# EAGLE design MatchboxARM (EAGLE 6.4)
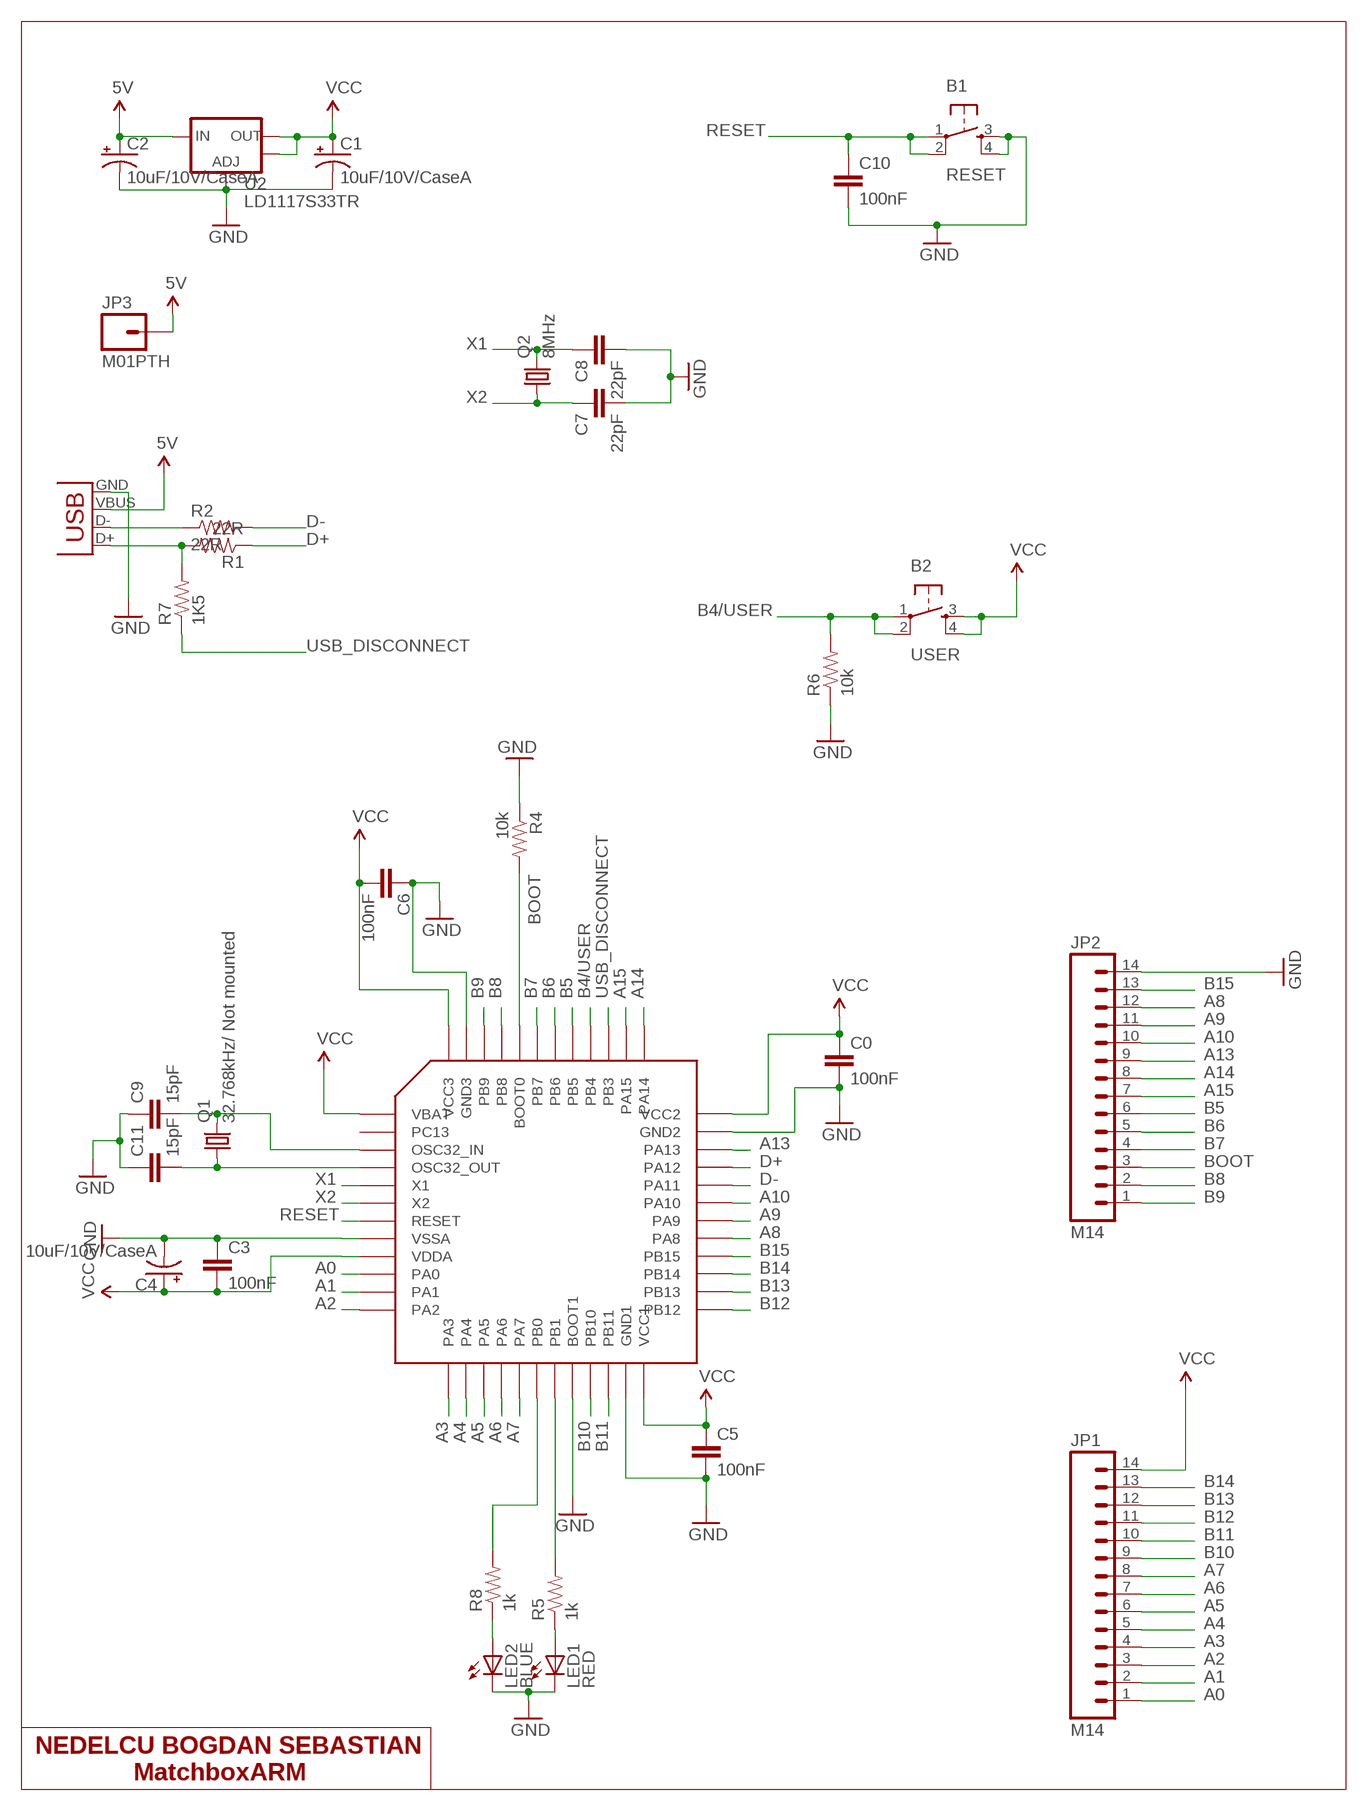
[diagram p0: schematic, sheet 1]

## Parts
B1  RESET  TAC_SWITCHSMD  [TACTILE_SWITCH_SMD]
B2  USER  TAC_SWITCHSMD  [TACTILE_SWITCH_SMD]
C0  100nF  CAP0603-CAP  [0603-CAP]
C1  10uF/10V/CaseA  CAP_POL1206  [EIA3216]
C2  10uF/10V/CaseA  CAP_POL1206  [EIA3216]
C3  100nF  CAP0603-CAP  [0603-CAP]
C4  10uF/10V/CaseA  CAP_POL1206  [EIA3216]
C5  100nF  CAP0603-CAP  [0603-CAP]
C6  100nF  CAP0603-CAP  [0603-CAP]
C7  22pF  CAP0603-CAP  [0603-CAP]
C8  22pF  CAP0603-CAP  [0603-CAP]
C9  15pF  CAP0603-CAP  [0603-CAP]
C10  100nF  CAP0603-CAP  [0603-CAP]
C11  15pF  CAP0603-CAP  [0603-CAP]
JP1  M14  [1X14]
JP2  M14  [1X14]
JP3  M01PTH  [1X01]
LED1  RED  LED0603  [LED-0603]
LED2  BLUE  LED0603  [LED-0603]
Q1  32.768kHz/ Not mounted  CRYSTALTC26V  [TC26V]
Q2  8MHz  CRYSTALCTS406  [CTS406]
R1  22R  RESISTOR0603-RES  [0603-RES]
R2  22R  RESISTOR0603-RES  [0603-RES]
R4  10k  RESISTOR0603-RES  [0603-RES]
R5  1k  RESISTOR0603-RES  [0603-RES]
R6  10k  RESISTOR0603-RES  [0603-RES]
R7  1K5  RESISTOR0603-RES  [0603-RES]
R8  1k  RESISTOR0603-RES  [0603-RES]
U1  STM32F103CBT6  STM32F103CXT6  [STM32F103CXT6]
U2  LD1117S33TR  V_REG_LM1117SOT223  [SOT223]
USB1  miniUSBSMD  USBSMD  [USB-MINIB]

## Nets
5V: C2.A(+) JP3.1 U2.3(IN) USB1.VBUS
A0: JP1.1 U1.10(PA0)
A1: JP1.2 U1.11(PA1)
A2: JP1.3 U1.12(PA2)
A3: JP1.4 U1.13(PA3)
A4: JP1.5 U1.14(PA4)
A5: JP1.6 U1.15(PA5)
A6: JP1.7 U1.16(PA6)
A7: JP1.8 U1.17(PA7)
A8: JP2.12 U1.29(PA8)
A9: JP2.11 U1.30(PA9)
A10: JP2.10 U1.31(PA10)
A13: JP2.9 U1.34(PA13)
A14: JP2.8 U1.37(PA14)
A15: JP2.7 U1.38(PA15)
B4/USER: B2.1 B2.2 R6.2 U1.40(PB4)
B5: JP2.6 U1.41(PB5)
B6: JP2.5 U1.42(PB6)
B7: JP2.4 U1.43(PB7)
B8: JP2.2 U1.45(PB8)
B9: JP2.1 U1.46(PB9)
B10: JP1.9 U1.21(PB10)
B11: JP1.10 U1.22(PB11)
B12: JP1.11 U1.25(PB12)
B13: JP1.12 U1.26(PB13)
B14: JP1.13 U1.27(PB14)
B15: JP2.13 U1.28(PB15)
BOOT: JP2.3 R4.2 U1.44(BOOT0)
D+: R1.1 U1.33(PA12)
D-: R2.2 U1.32(PA11)
GND: B1.3 B1.4 C0.2 C1.C(-) C2.C(-) C3.1 C4.C(-) C5.2 C6.1 C7.2 C8.2 C9.1 C10.2 C11.1 JP2.14 LED1.C LED2.C R4.1 R6.1 U1.8(VSSA) U1.20(BOOT1) U1.23(GND1) U1.35(GND2) U1.47(GND3) U2.1(ADJ) USB1.GND
N$1: R5.2 U1.19(PB1)
N$4: LED2.A R8.1
N$5: LED1.A R5.1
N$6: R8.2 U1.18(PB0)
N$7: C9.2 Q1.2 U1.3(OSC32_IN)
N$8: C11.2 Q1.1 U1.4(OSC32_OUT)
N$9: R2.1 USB1.D-
N$11: R1.2 R7.2 USB1.D+
RESET: B1.1 B1.2 C10.1 U1.7(RESET)
USB_DISCONNECT: R7.1 U1.39(PB3)
VCC: B2.3 B2.4 C0.1 C1.A(+) C3.2 C4.A(+) C5.1 C6.2 JP1.14 U1.1(VBAT) U1.9(VDDA) U1.24(VCC1) U1.36(VCC2) U1.48(VCC3) U2.2(OUT) U2.4(OUT)
X1: C8.1 Q2.3 U1.5(X1)
X2: C7.1 Q2.1 U1.6(X2)
Unconnected: U1.2(PC13)

## Notes on the sheet
- NEDELCU BOGDAN SEBASTIAN
- MatchboxARM

## Library data of the parts
B1 B2 = SparkFun-Electromechanical:TAC_SWITCH: Momentary Switch Button commonly used for reset or general input. Spark Fun Electronics SKU : COM-00097
C0 C3 C5-C11 = SparkFun-Passives:CAP: Capacitor Standard 0603 ceramic capacitor, and 0.1" leaded capacitor.
C1 C2 C4 = SparkFun-Passives:CAP_POL: Capacitor Polarized These are standard SMD and PTH capacitors. Normally 10uF, 47uF, and 100uF in electrolytic and tantalum varieties. Always verify the external diameter of the through hole cap, it varies with capacity, voltage, and manufacturer. The EIA devices should be standard.
JP1 JP2 = SparkFun-Connectors:M14: Header 14 Standard 14-pin 0.1" header. Use with straight break away headers (SKU : PRT-00116), right angle break away headers (PRT-00553), swiss pins (PRT-00743), machine pins (PRT-00117), and female headers (PRT-00115).
JP3 = SparkFun-Connectors:M01: Header 1 Standard 1-pin 0.1" header. Use with straight break away headers (SKU : PRT-00116), right angle break away headers (PRT-00553), swiss pins (PRT-00743), machine pins (PRT-00117), and female headers (PRT-00115).
LED1 LED2 = SparkFun-LED:LED: LEDs Standard schematic elements and footprints for 5mm, 3mm, 1206, and 0603 sized LEDs. 5mm - Spark Fun Electronics SKU : COM-00529 (and others)
Q1 Q2 = crystal:CRYSTAL: CRYSTAL; OC_FARNELL: unknown; OC_NEWARK: unknown
R1 R2 R4-R8 = SparkFun-Passives:RESISTOR: Resistor Basic schematic elements and footprints for 0603, 1206, and PTH resistors.
U1 = STM32F103CxT6:STM32F103CXT6
U2 = SparkFun-PowerIC:V_REG_LM1117: Voltage Regulator LM1117 Standard adjustable voltage regulator but in SMD form. Spark Fun Electronics SKU : COM-00595
USB1 = SparkFun-Connectors:USB: USB Connectors USB-B-PTH is fully proven SKU : PRT-00139 USB-miniB is fully proven SKU : PRT-00587 USB-A-PCB is untested. USB-A-H is throughly reviewed, but untested. Spark Fun Electronics SKU : PRT-00437 USB-B-SMT is throughly reviewed, but untested. Needs silkscreen touching up. USB-A-S has not been used/tested USB-MB-H has not been used/tested

## Board
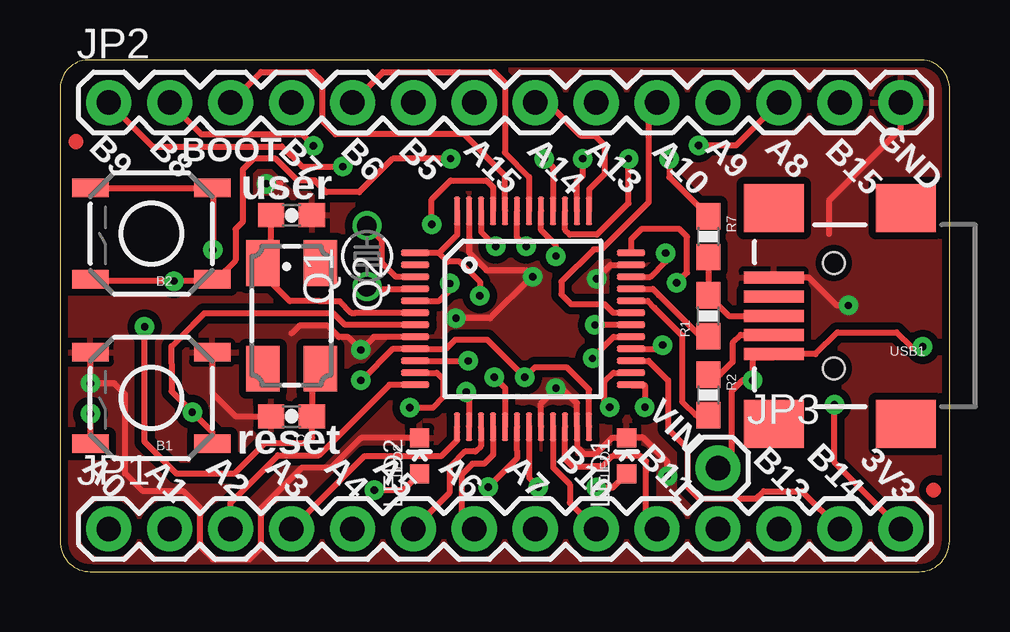
[diagram p1: board, top side]
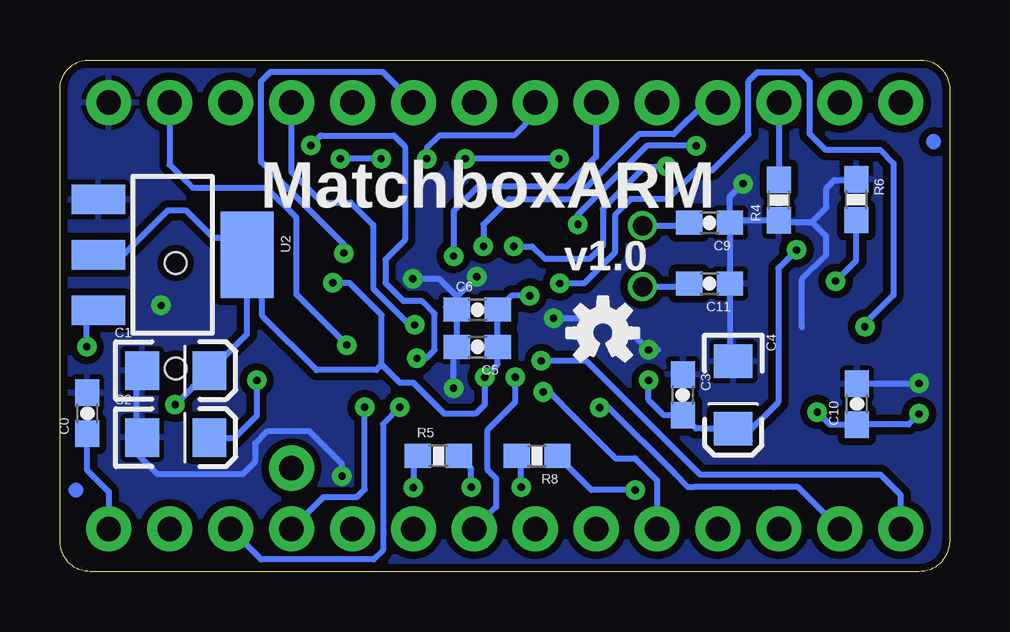
[diagram p2: board, bottom side, seen from below]

Size 37.08 x 21.34 mm. Coordinates in mm from the lower left corner, seen from the top.
Outline: 1.27,0 35.81,0 arc90 37.08,1.27 37.08,20.19 arc90 35.81,21.34 1.27,21.34 arc90 0,20.19 0,1.27 arc90 1.27,0
Copper layers (1*16): Top 0.035mm / dielectric 1.5mm / Bottom 0.035mm
Design rules "PCBCart-Standard *": minimum track width 8mil, minimum drill 0.4mm, track to track 8mil, track to pad 8mil, pad to pad 8mil, via to via 8mil, smd to smd 8mil, copper to edge 10mil, drill to drill 8mil, minimum pad ring 8mil, minimum via ring 10mil, stop-mask expansion 3mil, vias tented up to drill 0mil, thermal gap 8mil
tRestrict: area 0.4,17.6 to 1,18.2; area 36.1,3.1 to 36.7,3.7
bRestrict: area 0.4,17.6 to 1,18.2; area 36.1,3.1 to 36.7,3.7

### Footprints (pad centres in the part's own frame; a part is rotated, then mirrored left to right if it is on the bottom)
TACTILE_SWITCH_SMD = smd 1.524 x 0.762: 1 -2.54,1.905; 2 2.54,1.905; 3 -2.54,-1.905; 4 2.54,-1.905
0603-CAP = smd 1.1 x 1: 1 -0.85,0; 2 0.85,0
EIA3216 = smd 1.4 x 1.6: A 1.4,0; C -1.4,0
1X14 = drill 1.016 pad 1.88: 1 0,0; 2 2.54,0; 3 5.08,0; 4 7.62,0; 5 10.16,0; 6 12.7,0; 7 15.24,0; 8 17.78,0; 9 20.32,0; 10 22.86,0; 11 25.4,0; 12 27.94,0; 13 30.48,0; 14 33.02,0
1X01 = drill 1.016 pad 1.88: 1 0,0
LED-0603 = smd 0.8 x 0.8: A 0,-0.75; C 0,0.75
TC26V = drill 0.813: 1 -1.27,0; 2 1.27,0
CTS406 = smd 1.9 x 1.4: 1 -2.2,-1.2; 2 2.2,-1.2; 3 2.2,1.2; 4 -2.2,1.2
0603-RES = smd 1.1 x 1: 1 -0.85,0; 2 0.85,0
STM32F103CXT6 = smd 1.2 x 0.27: 1 -4.5,2.75; 2 -4.5,2.25; 3 -4.5,1.75; 4 -4.5,1.25; 5 -4.5,0.75; 6 -4.5,0.25; 7 -4.5,-0.25; 8 -4.5,-0.75; 9 -4.5,-1.25; 10 -4.5,-1.75; 11 -4.5,-2.25; 12 -4.5,-2.75; 25 4.5,-2.75; 26 4.5,-2.25; 27 4.5,-1.75; 28 4.5,-1.25; 29 4.5,-0.75; 30 4.5,-0.25; 31 4.5,0.25; 32 4.5,0.75; 33 4.5,1.25; 34 4.5,1.75; 35 4.5,2.25; 36 4.5,2.75 | smd 0.27 x 1.2: 13 -2.75,-4.5; 14 -2.25,-4.5; 15 -1.75,-4.5; 16 -1.25,-4.5; 17 -0.75,-4.5; 18 -0.25,-4.5; 19 0.25,-4.5; 20 0.75,-4.5; 21 1.25,-4.5; 22 1.75,-4.5; 23 2.25,-4.5; 24 2.75,-4.5; 37 2.75,4.5; 38 2.25,4.5; 39 1.75,4.5; 40 1.25,4.5; 41 0.75,4.5; 42 0.25,4.5; 43 -0.25,4.5; 44 -0.75,4.5; 45 -1.25,4.5; 46 -1.75,4.5; 47 -2.25,4.5; 48 -2.75,4.5
SOT223 = smd 1.219 x 2.235: 1 -2.311,-3.099; 2 0,-3.099; 3 2.311,-3.099 | smd 3.6 x 2.2: 4 0,3.099
USB-MINIB = smd 2.5 x 0.5: D+ 2.5,0; D- 2.5,0.8; GND 2.5,-1.6; ID 2.5,-0.8; VBUS 2.5,1.6 | smd 2.5 x 2: MTN1 -3,4.5; MTN2 2.5,4.5; MTN3 -3,-4.5; MTN4 2.5,-4.5 | hole 0.9: 0,2.2; 0,-2.2

### Placement (x,y rotation side)
B1  3.81,7.24 180 top
B2  3.81,14.1 180 top
C0  35.94,6.6 90 bottom
C1  32.26,8.38 0 bottom
C2  32.26,5.59 0 bottom
C3  11.13,7.37 270 bottom
C4  9.02,7.37 270 bottom
C5  19.68,9.37 180 bottom
C6  19.68,10.92 0 bottom
C7  9.65,14.86 0 top
C8  9.65,6.48 180 top
C9  10.01,14.55 180 bottom
C10  3.86,6.98 90 bottom
C11  10.01,12.01 180 bottom
JP1  2.03,1.78 0 top
JP2  2.03,19.56 0 top
JP3  27.43,4.32 0 top
LED1  23.62,4.83 0 top
LED2  14.99,4.83 0 top
Q1  12.8,13.16 90 top
Q2  9.65,10.67 270 top
R1  27.03,10.67 90 top
R2  27.03,7.37 270 top
R4  7.11,15.49 90 bottom
R5  21.31,4.83 0 bottom
R6  3.89,15.51 270 bottom
R7  27.03,13.97 270 top
R8  17.2,4.83 180 bottom
U1  19.3,10.54 0 top
U2  32.38,13.21 270 bottom
U3  CREATIVE_COMMONS  [CREATIVE_COMMONS]  -11.68,-10.9 0 top  (outside the outline)
U$4  OSHW-LOGOS  [OSHW-LOGO-S]  14.45,9.96 0 bottom
USB1  32.26,10.67 180 top

### Tracks (layer width: path | path; a pad name or v marks a point on that pad's centre or on a via)
5V  (via drill 0.3)
  Top 0.203: 29.74,8.94 USB1.VBUS 29.84,8.99 | 30.4,8.99 30.91,8.99
  Top 0.254: USB1.VBUS 29.76,8.94 28.88,8.94 v28.88,7.98 28.45,7.98 28.02,7.54 28.02,4.9 JP3.1 | USB1.VBUS 31.5,9.07 32.41,9.98 34.87,9.98 35.48,9.37 v35.97,9.37 | 30.4,8.99 30.33,9.07 USB1.VBUS
  Bottom 0.203: 30.61,5.59 C2.A
  Bottom 0.254: v35.97,9.37 35.97,10.41 U2.3 | v28.88,7.98 28.88,6.5 29.82,5.56 30.58,5.56 C2.A
A0  (via drill 0.3)
  Top 0.203: U1.10
  Top 0.254: U1.10 v17.02,8.79
  Bottom 0.254: JP1.1 2.03,3.2 2.87,4.04 10.39,4.04 13.08,6.73 15.14,8.79 v17.02,8.79
A1  (via drill 0.3)
  Top 0.203: U1.11
  Top 0.254: U1.11 15.72,8.29 15.98,8.03 15.98,7.26 15.54,6.83 v14.58,6.83
  Bottom 0.254: JP1.2 6.33,3.53 7.32,3.53 10.64,3.53 10.9,3.53 11.46,4.09 14.2,6.83 v14.58,6.83
A2
  Top 0.203: 14.78,7.77 U1.12
  Top 0.254: JP1.3 7.11,2.87 9.09,4.85 10.79,4.85 13.73,7.79 U1.12
A3
  Top 0.203: 16.54,6.02 U1.13
  Top 0.254: 16.55,5.81 U1.13 16.55,5.48 15.9,4.83 13.03,4.83 12.7,4.83 JP1.4
A4  (via drill 0.3)
  Top 0.203: 17.02,6.07 U1.14
  Top 0.254: v16.94,7.49 17.05,7.38 U1.14
  Bottom 0.254: JP1.5 12.19,3.81 13.11,4.72 13.92,4.72 15.57,6.38 16.69,7.49 v16.94,7.49
A5
  Top 0.203: 17.55,6.02 U1.15
  Top 0.254: 17.55,6.02 17.55,5.23 17.32,5 16.89,5 16.28,4.39 16.23,4.34 16.23,3.28 JP1.6
A6
  Top 0.254: JP1.7 16.74,2.31 16.74,4.04 16.76,4.06 17.2,4.5 17.68,4.5 18.03,4.85 18.05,4.87 U1.16
A7  (via drill 0.3)
  Top 0.203: U1.17
  Top 0.254: v18.11,8.1 18.55,7.66 U1.17
  Bottom 0.254: v18.11,8.1 18.11,7.06 19.25,5.92 19.25,4.24 18.9,3.89 18.9,2.69 JP1.8
A8  (via drill 0.3)
  Top 0.203: U1.29
  Top 0.254: U1.29 23.07,9.79 22.2,8.91 v22.2,8.89 | v26.62,17.78 28.19,17.78 JP2.12
  Bottom 0.254: v22.2,8.89 21.82,8.89 21.46,9.25 21.46,10.74 22,11.28 22.76,11.28 23.52,12.04 23.52,13.01 22.71,13.82 22.71,17.73 23.16,18.19 26.21,18.19 v26.62,17.78
A9  (via drill 0.3)
  Top 0.203: U1.30
  Top 0.254: U1.30 v22.3,10.29
  Bottom 0.254: v22.3,10.29 22.5,10.29 24.03,11.81 24.03,14.45 24.97,15.39 26.16,15.39 27.43,16.66 JP2.11
A10
  Top 0.203: U1.31
  Top 0.254: U1.31 23.07,10.79 22.71,11.15 21.31,11.15 20.9,11.56 20.9,12.09 22.25,13.44 22.58,13.44 24.54,15.39 24.54,19.2 JP2.10
A13  (via drill 0.3)
  Top 0.203: 23.82,12.29 U1.34
  Top 0.254: U1.34 24.61,12.29 25.25,12.93 v25.25,13.28
  Bottom 0.254: JP2.9 23.62,20.83 28.32,20.83 28.7,20.45 28.7,17.09 25.25,13.64 v25.25,13.28
A14
  Top 0.203: 22.05,15.06 U1.37
  Top 0.254: U1.37 22.05,15.93 22.71,16.59 22.71,17.78 22.3,18.19 21.69,18.19 20.32,19.56 JP2.8
A15  (via drill 0.3)
  Top 0.254: U1.38 21.55,15.05 21.55,16.27 21.79,16.51 v21.79,17.22
  Bottom 0.254: v21.79,17.22 21.79,17.65 21.26,18.19 18.16,18.19 17.27,19.07 JP2.7
B4/USER  (via drill 0.3)
  Top 0.203: 6.35,12.12 B2.1 6.4,12.27
  Top 0.254: U1.40 20.55,16.86 v20.19,17.22 | v16.28,17.22 13.87,17.22 12.47,15.82 11.1,15.82 10.62,16.31 9.91,16.31 8.99,17.22 8.08,17.22 7.62,16.76 7.62,14.58 7.32,14.28 7.32,12.98 6.53,12.19 B2.1 | 6.35,12.12 v4.75,12.12 1.35,12.12 arc-90 B2.2
  Bottom 0.254: v4.75,12.12 3.89,12.97 R6.2 | v16.28,17.22 v20.19,17.22
B5  (via drill 0.3)
  Top 0.254: v20.68,13.16 20.68,13.61 20.05,14.24 U1.41
  Bottom 0.254: JP2.6 14.73,17.3 15.98,16.05 19.66,16.05 20.68,15.04 v20.68,13.16
B6
  Top 0.254: JP2.5 13.46,20.83 18.11,20.83 18.54,20.4 18.54,17.48 19.56,16.46 U1.42
B7  (via drill 0.3)
  Top 0.203: 19.07,15.04 U1.43
  Top 0.254: v19.43,13.56 19.05,13.94 U1.43
  Bottom 0.254: JP2.4 10.19,19.56 11.51,18.24 12.95,18.24 15.65,15.54 18.36,15.54 19.43,14.48 v19.43,13.56
B8  (via drill 0.3)
  Top 0.203: 18.03,15.06 U1.45
  Top 0.254: v15.49,14.48 15.49,15.52 16.28,16.31 17.78,16.31 18.06,16.03 U1.45 | JP2.2 5.89,18.24 10.08,18.24 v10.57,17.75
  Bottom 0.254: v10.57,17.75 12.62,17.75 15.49,14.88 v15.49,14.48
B9  (via drill 0.3)
  Top 0.254: U1.46 17.55,14.17 v18.16,13.56 | JP2.1 3.86,17.73 9.25,17.73 10.08,16.89 v11.79,16.89
  Bottom 0.254: v18.16,13.56 17.4,13.56 16.89,13.06 14.99,13.06 14.45,13.59 14.45,15.14 12.7,16.89 v11.79,16.89
B10
  Top 0.203: 20.57,6.02 U1.21
  Top 0.254: U1.21 20.55,4.34 21.26,3.63 21.26,2.87 JP1.9
B11
  Top 0.254: U1.22 21.05,4.7 21.36,4.39 22.25,4.39 22.61,4.39 23.04,4.83 24.21,4.83 24.43,4.6 24.43,4.17 24.43,2.23 JP1.10
B12  (via drill 0.3)
  Top 0.203: 23.82,7.77 U1.25
  Top 0.254: 23.82,7.77 24.38,7.77 v24.38,6.86
  Bottom 0.254: JP1.11 26.11,3.1 24.71,3.1 24.38,3.43 v24.38,6.86
B13  (via drill 0.3)
  Top 0.203: U1.26
  Top 0.254: v22.91,6.86 22.71,7.06 22.71,7.92 23.07,8.29 U1.26
  Bottom 0.254: JP1.12 28.7,0.51 24,0.51 23.62,0.89 23.62,6.15 v22.91,6.86
B14
  Top 0.203: 23.82,8.79 U1.27
  Top 0.254: 23.82,8.79 24.54,8.79 25.35,7.98 25.35,5.94 26.16,5.13 26.16,3.53 26.64,3.05 29.03,3.05 29.34,3.35 30.94,3.35 JP1.13
B15  (via drill 0.3)
  Top 0.203: 23.82,9.29 U1.28
  Top 0.254: 23.82,9.29 24.97,9.29 v25.12,9.45
  Bottom 0.254: JP2.13 32.51,16.97 31.75,16.2 31.55,16 28.47,16 27.23,14.76 27.23,11.56 v25.12,9.45
BOOT
  Top 0.203: 18.56,15.06 U1.44
  Top 0.254: JP2.3 8.38,20.83 10.54,20.83 10.92,20.45 10.92,18.8 11.48,18.24 16.84,18.24 18.56,16.52 18.56,15.06
  Bottom 0.254: JP2.3 R4.2
D+
  Top 0.203: 23.82,11.79 U1.33
  Top 0.254: 23.82,11.79 24.71,11.79 24.97,11.53 26.68,9.82 R1.1 26.81,9.69
D-
  Top 0.203: 23.82,11.29 U1.32
  Top 0.254: 23.82,11.29 24.5,11.29 24.79,11 25.93,9.86 25.93,7.09 26.5,6.52 R2.2
GND  (via drill 0.3)
  Top 0.203: 29.77,12.14 USB1.GND | 14.99,5.82 LED2.C | 23.62,5.82 LED1.C 23.7,5.77 | 23.8,12.78 U1.35 | 8.79,6.35 C8.2 8.71,6.55 | 10.49,14.73 C7.2
  Top 0.254: U1.47 17.05,13.3 17.78,12.57 19.43,12.57 v19.71,12.29 19.66,12.29 17.93,10.57 v16.51,10.57 | 8.71,6.55 9.04,6.55 | U1.8 13.09,9.79 v12.55,9.25 12.01,9.78 11.63,9.78 11.15,10.26 9.98,10.26 9.65,9.93 | B1.4 v1.27,7.85 2.26,7.85 2.72,7.39 2.72,4.09 3.45,3.35 5.16,3.35 5.84,2.67 5.84,1.04 6.38,0.51 7.9,0.51 8.38,0.99 8.38,2.64 10.08,4.34 11.33,4.34 12.57,5.59 14.97,5.59 LED2.C | v8.61,16.18 9.2,16.18 | 10.5,14.87 C7.2 | B1.3 6.35,7.44 7.32,6.48 C8.2 8.97,6.48 | LED1.C 23.04,5.59 22.35,4.9 21.84,4.9 21.55,5.19 U1.23 21.55,7.02 20.93,7.64 v20.68,7.64 20.05,7.02 U1.20 | v25.32,3.99 25.32,4.57 24.31,5.59 LED1.C | LED1.C | v22.38,12.22 22.95,12.79 U1.35 | v32.87,11.1 32.38,11.1 31.22,12.27 USB1.GND 30.23,12.27 | 32.05,14.1 32.05,15.47 35.05,18.47 JP2.14
  Bottom 0.203: 35.94,7.47 C0.2 | 33.91,5.59 C2.C 33.81,5.56 | 33.91,8.31 C1.C 33.91,8.48 | 9.12,14.76 C9.1 | 3.86,7.85 C10.2 3.79,7.77 3.63,7.77 | 7.01,14.58 R4.1
  Bottom 0.254: R4.1 9.07,14.64 C9.1 | C9.1 C11.1 9.16,9.16 C4.C | 3.86,7.85 3.86,7.9 | 6.15,10.19 6.15,12.19 5.16,13.18 5.16,13.99 5.74,14.58 | 3.69,7.83 C10.2 | 3.72,7.7 C10.2 | 33.91,8.31 33.91,5.59 C2.C 33.91,4.95 33.02,4.06 29.46,4.06 28.96,4.57 28.96,5.33 28.45,5.84 26.67,5.84 25.32,4.5 v25.32,3.99 | 35.05,15.95 U2.1 | R6.1 3.92,16.33 4.8,16.33 5.13,16 5.13,15.19 5.74,14.58 | 7.01,14.58 5.74,14.58 | C9.1 9.16,15.63 v8.61,16.18 | v20.68,7.64 20.68,9.23 C5.2 C6.1 20.54,11.47 | v16.51,10.57 13.87,10.57 v12.55,9.25 12.15,9.25 | v1.27,7.85 1.28,7.83 C10.2 | v19.71,12.29 20.54,11.47 | v22.38,12.22 21.28,12.22 20.54,11.47
  pour Bottom (isolate 0.305): -0.79,22.5 39.27,22.5 39.27,-1.75 -0.79,-1.75
  pour Top (isolate 0.305): -0.69,22.45 38.38,22.45 38.38,-1.19 -0.69,-1.19
N$1  (via drill 0.3)
  Top 0.254: U1.19 19.55,3.92 v19.94,3.53
  Bottom 0.203: 20.45,4.83 R5.2
  Bottom 0.254: 20.45,4.81 R5.2 19.94,4.3 v19.94,3.53
N$4  (via drill 0.3)
  Top 0.203: 14.99,4.32 LED2.A
  Top 0.254: v13.11,3.4 14.31,3.4 LED2.A
  Bottom 0.254: v13.11,3.4 14.92,3.4 R8.1
N$5  (via drill 0.3)
  Top 0.203: 23.62,4.32 LED1.A
  Top 0.254: v22.35,3.5 23.05,3.5 LED1.A
  Bottom 0.203: 22.17,4.83 R5.1
  Bottom 0.254: R5.1 22.35,4.63 v22.35,3.5
N$6  (via drill 0.3)
  Top 0.203: 19.05,6.02 U1.18
  Top 0.254: U1.18 19.05,6.03 19.05,5.03 19.05,4.96 19.05,4.73 v17.86,3.53
  Bottom 0.254: v17.86,3.53 17.86,4.83 R8.2
N$7
  Top 0.203: 14.78,12.29 U1.3
  Top 0.254: 14.78,12.29 14.02,12.29 13.44,12.88 13.44,13.79 Q1.2
  Bottom 0.203: 10.87,14.55 C9.2
  Bottom 0.254: Q1.2 10.98,14.43 C9.2
N$8
  Top 0.203: 14.78,11.81 U1.4
  Top 0.254: Q1.1 12.9,11.79 U1.4
  Bottom 0.203: 10.87,12.01 C11.2
  Bottom 0.254: Q1.1 10.98,11.89 C11.2
N$9
  Top 0.254: USB1.D- 28.39,9.87 28.04,9.53 28.04,8.74 27.52,8.22 R2.1
N$11
  Top 0.203: 26.92,11.4 R1.2 27,11.33 | 26.92,12.98 R7.2 | 29.74,10.54 USB1.D+
  Top 0.254: 26.92,12.98 27.03,12.88 R1.2 27.88,10.67 USB1.D+
RESET  (via drill 0.3)
  Top 0.254: U1.7 11.89,10.29 11.4,10.77 6.02,10.77 5.54,10.29 4.65,9.4 4.65,8.69 4.65,7.52 v5.51,6.66 6.35,5.82 B1.1 | v1.27,6.58 B1.2
  Bottom 0.203: C10.1 3.79,6.07
  Bottom 0.254: C10.1 3.87,6.12 4.98,6.12 v5.51,6.66 | 3.7,6.3 C10.1 | v1.27,6.58 1.71,6.13 C10.1
USB_DISCONNECT  (via drill 0.3)
  Top 0.203: 26.92,14.71 R7.1
  Top 0.254: U1.39 21.06,14.25 21.26,14.05 22.38,14.05 23.7,15.37 v23.7,17.22 | v25.4,17.22 25.4,16.45 R7.1
  Bottom 0.254: v23.7,17.22 v25.4,17.22
VCC  (via drill 0.3)
  Top 0.203: 6.38,15.93 B2.3 | 23.82,13.31 U1.36
  Top 0.254: U1.24 22.05,7.59 21.11,8.53 19.81,8.53 v19.38,8.1 17.8,9.68 16.48,9.68 16.1,9.29 U1.9 13.89,9.3 12.57,7.98 v12.55,7.98 | U1.48 16.55,14.04 15.81,13.29 | 15.81,13.29 U1.1 | JP1.14 32.28,4.55 v32.28,6.96 | B2.4 B2.3 | 6.38,15.93 v6.38,13.41 | U1.36 23.8,13.85 24.26,14.3 25.81,14.3 26.14,13.97 26.14,12.47 v25.7,12.04 | 15.81,13.29 16.17,12.93 16.66,12.93 17.5,12.09 v17.5,11.51
  Bottom 0.203: 8.97,5.84 C4.A | 29.29,13.56 29.29,13.46 U2.4 29.29,13.39 | C0.1 | 30.61,8.59 30.61,8.38 C1.A 30.66,8.31
  Bottom 0.254: v6.38,13.41 7.14,12.65 7.14,7.06 8.48,5.72 C4.A 10.32,5.97 10.58,5.97 C3.2 11.9,6.52 12.55,7.16 v12.55,7.98 | 23.67,8.64 22.91,7.87 22.35,7.87 21.06,6.58 19.76,6.58 19.38,6.96 v19.38,8.1 18.84,8.65 C5.1 C6.2 18.25,11.51 v17.5,11.51 | 23.67,8.64 23.9,8.41 26.39,8.41 28.65,10.67 28.65,13.46 U2.4 | 30.61,8.59 29.29,9.91 U2.4 | v32.28,6.96 C1.A | C0.1 35.94,4.22 35.05,3.33 JP1.14 | U2.4 30,13.92 30.68,13.92 31.83,15.06 32.59,15.06 34.44,13.21 U2.2 | 23.67,8.64 23.67,10.69 25.02,12.04 v25.7,12.04
X1  (via drill 0.3)
  Top 0.203: 14.81,11.3 U1.5 | 10.39,6.3 C8.1
  Top 0.254: Q2.3 10.5,7.99 C8.1 10.52,6.34 10.52,5.59 10.29,5.36 8.56,5.36 7.29,4.09 4.85,4.09 3.53,5.41 v3.53,10.21 | U1.5 14.74,11.29 15.81,11.29 16.26,11.73 v16.26,12.01
  Bottom 0.254: v16.26,12.01 15.24,12.01 13.95,13.31 13.95,14.88 13.28,15.54 11.73,15.54 10.54,16.74 9.88,16.74 8.38,18.24 8.38,20.45 8,20.83 6.22,20.83 5.84,20.45 5.84,18.26 5.16,17.58 2.9,17.58 2.34,17.02 2.34,11.53 3.53,10.34 v3.53,10.21
X2
  Top 0.203: 8.51,12.62 Q2.1
  Top 0.254: Q2.1 8.8,13.09 C7.1 | 8.51,12.62 8.51,12.34 | 8.51,12.34 8.51,12.17 | U1.6 12.32,10.79 12.14,10.79 11.66,11.28 11.56,11.28 10.82,11.28 9.58,11.28 8.51,12.34
(copper drawn outside any net)
  shapes: Bottom circle x2, Top circle x2

### Text on the board
tPlace: BOOT | B9 | B8 | B7 | B6 | B5 | A9 | A8 | user | A15 | A14 | A13 | A10 | B15 | GND | VIN | reset | A0 | A1 | A2 | A3 | A4 | A5 | A6 | A7 | B10 | B11 | B14 | 3V3 | B13
bPlace: MatchboxARM | v1.0
tValues: Nedelcu Bogdan Sebastian